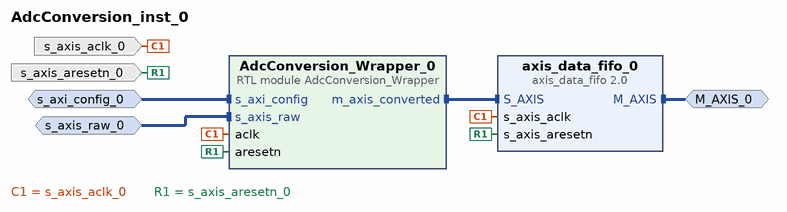
[diagram p0: block diagram of the top level]
# Vivado block design AdcConversion_inst_0, xck26-sfvc784-2LV-c, Vivado 2025.2
create_bd_design AdcConversion_inst_0

create_bd_intf_port -mode Slave -vlnv xilinx.com:interface:axis_rtl:1.0 s_axis_raw_0
create_bd_intf_port -mode Slave -vlnv xilinx.com:interface:aximm_rtl:1.0 s_axi_config_0
create_bd_intf_port -mode Master -vlnv xilinx.com:interface:axis_rtl:1.0 M_AXIS_0
create_bd_port -dir I -type rst s_axis_aresetn_0
create_bd_port -dir I -type clk s_axis_aclk_0

create_bd_cell -type module -reference AdcConversion_Wrapper AdcConversion_Wrapper_0
create_bd_cell -type ip -vlnv xilinx.com:ip:axis_data_fifo:2.0 axis_data_fifo_0
set_property -dict [list \
  CONFIG.FIFO_DEPTH 16 \
  CONFIG.HAS_TKEEP 1 \
  CONFIG.HAS_TLAST 1 \
  CONFIG.TDATA_NUM_BYTES 64 \
  CONFIG.TUSER_WIDTH 384 \
] [get_bd_cells axis_data_fifo_0]

# ---- connections ----

connect_bd_intf_net [get_bd_intf_pins AdcConversion_Wrapper_0/m_axis_converted] [get_bd_intf_pins axis_data_fifo_0/S_AXIS]
connect_bd_intf_net [get_bd_intf_ports M_AXIS_0] [get_bd_intf_pins axis_data_fifo_0/M_AXIS]
connect_bd_intf_net -intf_net s_axi_config_0_1 [get_bd_intf_ports s_axi_config_0] [get_bd_intf_pins AdcConversion_Wrapper_0/s_axi_config]
connect_bd_intf_net -intf_net s_axis_raw_0_1 [get_bd_intf_ports s_axis_raw_0] [get_bd_intf_pins AdcConversion_Wrapper_0/s_axis_raw]
connect_bd_net -net s_axis_aclk_0_1 [get_bd_ports s_axis_aclk_0] [get_bd_pins axis_data_fifo_0/s_axis_aclk] [get_bd_pins AdcConversion_Wrapper_0/aclk]
connect_bd_net -net s_axis_aresetn_0_1 [get_bd_ports s_axis_aresetn_0] \
  [get_bd_pins axis_data_fifo_0/s_axis_aresetn] [get_bd_pins AdcConversion_Wrapper_0/aresetn]

# ---- address map ----
assign_bd_address -offset 0x0000 -range 64K -target_address_space [get_bd_addr_spaces s_axi_config_0] [get_bd_addr_segs AdcConversion_Wrapper_0/s_axi_config/reg0]
assign_bd_address -offset 0x0000 -range 64K -target_address_space [get_bd_addr_spaces s_axi_config_0] [get_bd_addr_segs AdcConversion_Wrapper_0/s_axi_config/reg0]

validate_bd_design
save_bd_design
